# EAGLE design main (EAGLE 9.2.0)
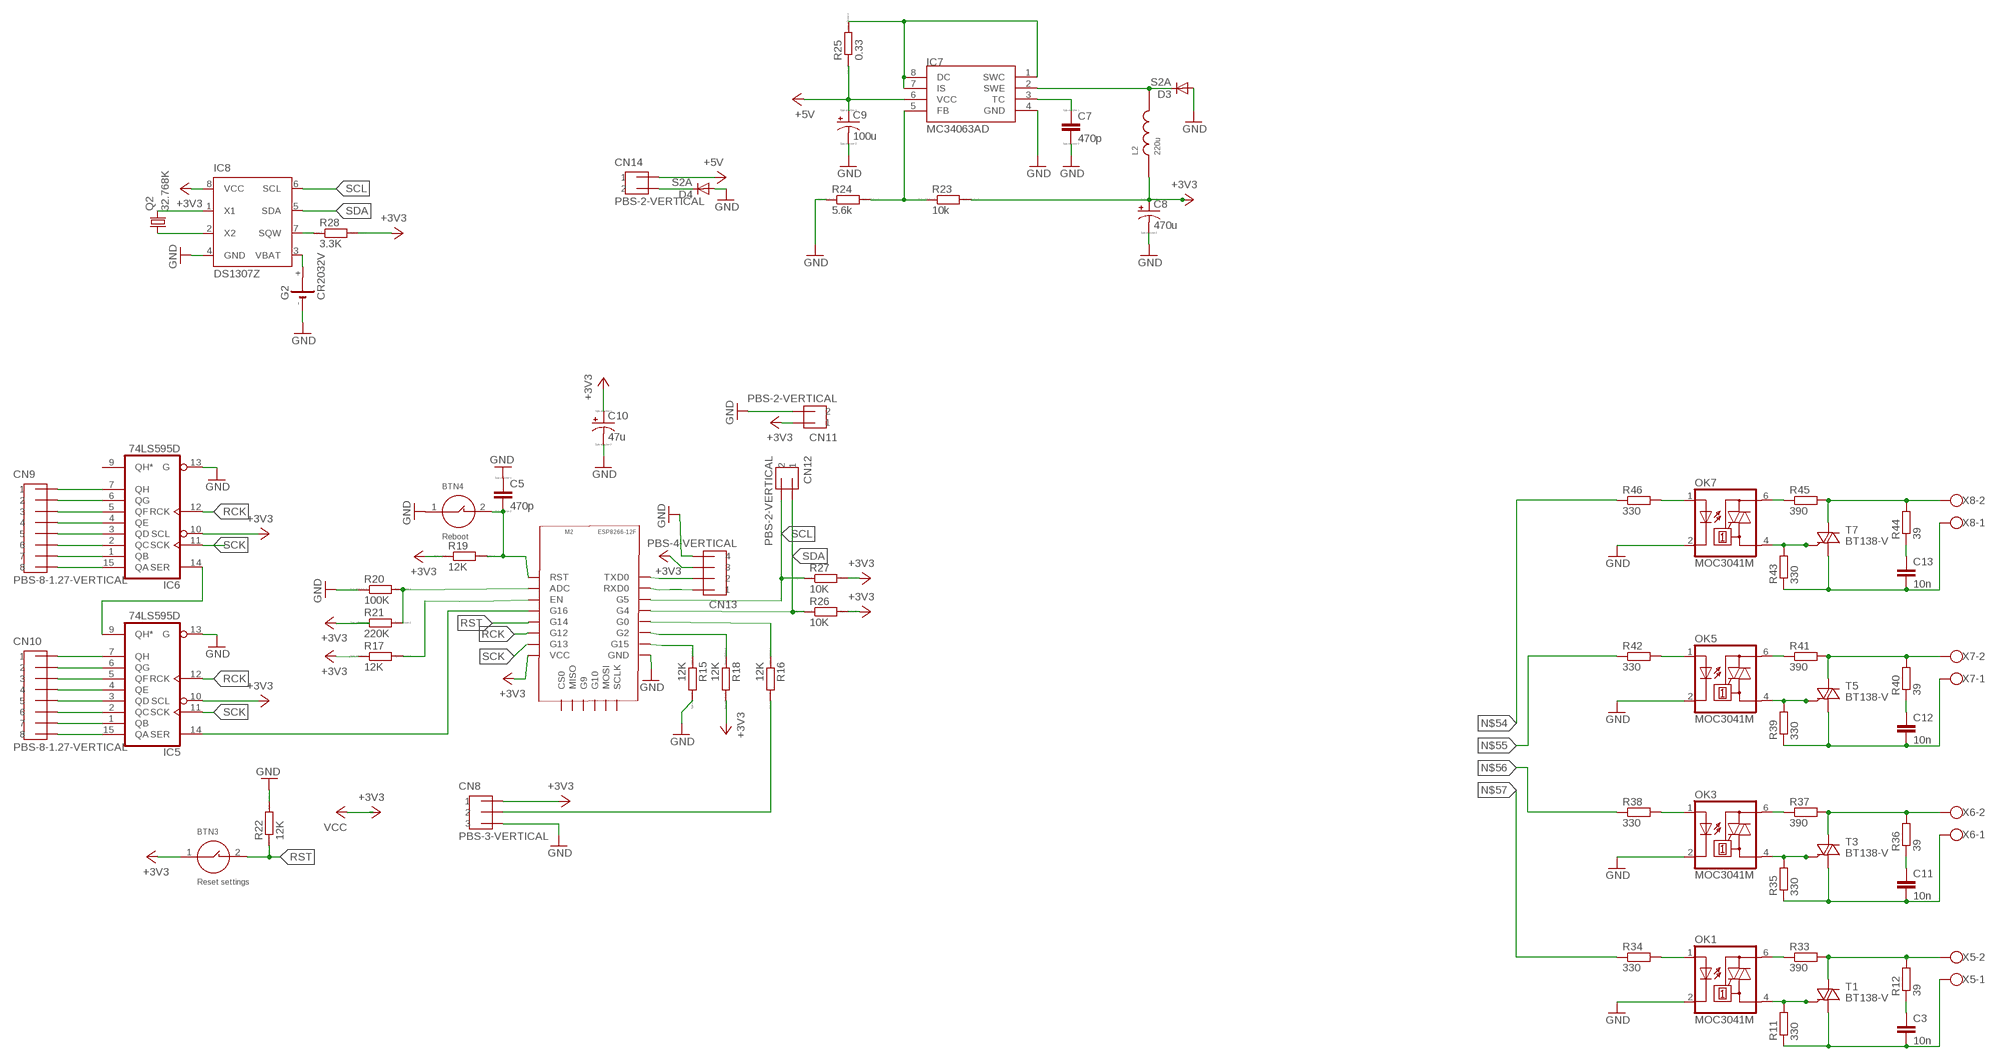
[diagram p0: schematic, sheet 1]

## Parts
BTN3  Reset settings  BTN-6X4-SMD  [BTN-6X4-SMD]
BTN4  Reboot  BTN-6X4-SMD  [BTN-6X4-SMD]
C3  10n  C10/5  [C10B5]
C5  470p  CC0603  [C0603]
C7  470p  CC0603  [C0603]
C8  470u  CPOL-USD/7343-31W  [D/7343-31W]
C9  100u  CPOL-USD/7343-31W  [D/7343-31W]
C10  47u  CPOL-USCT3216  [CT3216]
C11  10n  C10/5  [C10B5]
C12  10n  C10/5  [C10B5]
C13  10n  C10/5  [C10B5]
CN8  PBS-3-VERTICAL  [PBS-3-VERTICAL]
CN9  PBS-8-1.27-VERTICAL  [PBS-8-1.27-VERTICAL]
CN10  PBS-8-1.27-VERTICAL  [PBS-8-1.27-VERTICAL]
CN11  PBS-2-VERTICAL  [PBS-2-VERTICAL]
CN12  PBS-2-VERTICAL  [PBS-2-VERTICAL]
CN13  PBS-4-VERTICAL  [PBS-4-VERTICAL]
CN14  PBS-2-VERTICAL  [PBS-2-VERTICAL]
D3  S2A  [DO214AA]
D4  S2A  [DO214AA]
G2  CR2032V  [CR2032V]
IC5  74LS595D  [SO16]
IC6  74LS595D  [SO16]
IC7  MC34063AD  [SOIC8]
IC8  DS1307Z  [SOIC8]
L2  220u  INDUCTOR-5-10  [INDUCTOR-5-10]
M2  ESP8266-12F  [ESP8266-12F]
OK1  MOC3041M  [DIL06]
OK3  MOC3041M  [DIL06]
OK5  MOC3041M  [DIL06]
OK7  MOC3041M  [DIL06]
Q2  32.768K  CRYSTALTC38H  [TC38H]
R11  330  R-EU_0411/12  [0411/12]
R12  39  R-EU_0411/12  [0411/12]
R15  12K  RR0603  [R0603]
R16  12K  RR0603  [R0603]
R17  12K  RR0603  [R0603]
R18  12K  RR0603  [R0603]
R19  12K  RR0603  [R0603]
R20  100K  RR0603  [R0603]
R21  220K  RR0603  [R0603]
R22  12K  RR0603  [R0603]
R23  10k  RR0603  [R0603]
R24  5.6k  RR0603  [R0603]
R25  0.33  RR0603  [R0603]
R26  10K  RR0603  [R0603]
R27  10K  RR0603  [R0603]
R28  3.3K  RR0603  [R0603]
R33  390  R-EU_0411/12  [0411/12]
R34  330  R-EU_R0603  [R0603]
R35  330  R-EU_0411/12  [0411/12]
R36  39  R-EU_0411/12  [0411/12]
R37  390  R-EU_0411/12  [0411/12]
R38  330  R-EU_R0603  [R0603]
R39  330  R-EU_0411/12  [0411/12]
R40  39  R-EU_0411/12  [0411/12]
R41  390  R-EU_0411/12  [0411/12]
R42  330  R-EU_R0603  [R0603]
R43  330  R-EU_0411/12  [0411/12]
R44  39  R-EU_0411/12  [0411/12]
R45  390  R-EU_0411/12  [0411/12]
R46  330  R-EU_R0603  [R0603]
T1  BT138-V  [TO220BV]
T3  BT138-V  [TO220BV]
T5  BT138-V  [TO220BV]
T7  BT138-V  [TO220BV]
X5  W237-102  [W237-102]
X6  W237-102  [W237-102]
X7  W237-102  [W237-102]
X8  W237-102  [W237-102]

## Nets
+3V3: BTN3.1 C8.+ C10.-(+) CN8.P$1 CN11.P$1 CN13.P$3 IC5.10(SCL) IC6.10(SCL) IC8.8(VCC) L2.P$1 M2.VCC R17.1 R18.2 R19.1 R21.1 R23.2 R26.2 R27.2 R28.2 ; supply symbol labelled VCC
+5V: C9.+ CN14.P$1 IC7.6(VCC) R25.1
GND: BTN4.1 C5.1 C7.2 C8.- C9.- C10.+(-) CN8.P$3 CN11.P$2 CN13.P$4 D3.A D4.A G2.- IC5.13(G) IC6.13(G) IC7.4(GND) IC8.4(GND) M2.GND OK1.2(C) OK3.2(C) OK5.2(C) OK7.2(C) R15.2 R20.1 R22.2 R24.1
N$22: OK1.1(A) R34.2
N$23: OK1.6(A2) R33.1
N$24: OK1.4(A1) R11.2 T1.G
N$32: R12.2 R33.2 T1.T2(A2) X5.2
N$33: C3.2 R11.1 T1.T1(A1) X5.1
N$34: C3.1 R12.1
N$36: OK3.1(A) R38.2
N$37: M2.G15 R15.1
N$38: M2.G2 R18.1
N$39: M2.G0 R16.1
N$40: CN8.P$2 R16.2
N$41: M2.EN R17.2
N$42: CN9.P$1 IC6.7(QH)
N$43: CN9.P$2 IC6.6(QG)
N$44: CN9.P$3 IC6.5(QF)
N$45: CN9.P$4 IC6.4(QE)
N$46: CN9.P$5 IC6.3(QD)
N$47: CN9.P$6 IC6.2(QC)
N$48: CN9.P$7 IC6.1(QB)
N$49: CN9.P$8 IC6.15(QA)
N$50: CN10.P$1 IC5.7(QH)
N$51: CN10.P$2 IC5.6(QG)
N$52: CN10.P$3 IC5.5(QF)
N$53: CN10.P$4 IC5.4(QE)
N$54: CN10.P$5 IC5.3(QD) R46.1
N$55: CN10.P$6 IC5.2(QC) R42.1
N$56: CN10.P$7 IC5.1(QB) R38.1
N$57: CN10.P$8 IC5.15(QA) R34.1
N$58: IC5.14(SER) M2.G16
N$59: IC5.9(QH*) IC6.14(SER)
N$60: BTN4.2 C5.2 M2.RST R19.2
N$61: CN13.P$1 M2.RXD0
N$62: CN13.P$2 M2.TXD0
N$63: M2.ADC R20.2 R21.2
N$64: IC8.7(SQW) R28.1
N$65: IC8.1(X1) Q2.2
N$66: IC8.2(X2) Q2.1
N$67: G2.+ IC8.3(VBAT)
N$68: IC7.5(FB) R23.1 R24.2
N$69: IC7.1(SWC) IC7.7(IS) IC7.8(DC) R25.2
N$70: C7.1 IC7.3(TC)
N$71: D3.C IC7.2(SWE) L2.P$2
N$72: CN14.P$2 D4.C
N$73: OK3.6(A2) R37.1
N$74: OK3.4(A1) R35.2 T3.G
N$75: R36.2 R37.2 T3.T2(A2) X6.2
N$76: C11.2 R35.1 T3.T1(A1) X6.1
N$77: C11.1 R36.1
N$79: OK5.1(A) R42.2
N$80: OK5.6(A2) R41.1
N$81: OK5.4(A1) R39.2 T5.G
N$82: R40.2 R41.2 T5.T2(A2) X7.2
N$83: C12.2 R39.1 T5.T1(A1) X7.1
N$84: C12.1 R40.1
N$86: OK7.1(A) R46.2
N$87: OK7.6(A2) R45.1
N$88: OK7.4(A1) R43.2 T7.G
N$89: R44.2 R45.2 T7.T2(A2) X8.2
N$90: C13.2 R43.1 T7.T1(A1) X8.1
N$91: C13.1 R44.1
RCK: IC5.12(RCK) IC6.12(RCK) M2.G12
RST: BTN3.2 M2.G14 R22.1
SCK: IC5.11(SCK) IC6.11(SCK) M2.G13
SCL: CN12.P$2 IC8.6(SCL) M2.G5 R27.1
SDA: CN12.P$1 IC8.5(SDA) M2.G4 R26.1
Unconnected: G2.+@1(+) IC6.9(QH*) M2.CS0 M2.G9 M2.G10 M2.MISO M2.MOSI M2.SCLK

## Power pins joined to a net without a drawn wire
+3V3: IC5.16(VCC) IC6.16(VCC)
GND: IC5.8(GND) IC6.8(GND)

## Library data of the parts
BTN3 BTN4 = btn1:BTN-6X4-SMD
C3 C11-C13 = capacitor-wima:C: CAPACITOR naming: grid - package width
C5 C7 = eagle-ltspice:C: CAPACITOR, European symbol; SPICEMODEL: NONE; SPICEPREFIX: C
C8-C10 = resistor:CPOL-US: POLARIZED CAPACITOR, American symbol
CN8 = pls:PBS-3-VERTICAL
CN9 CN10 = pls:PBS-8-1.27-VERTICAL
CN11 CN12 CN14 = pls:PBS-2-VERTICAL
CN13 = pls:PBS-4-VERTICAL
D3 D4 = s2x_10:S2*: S2A - S2M General Purpose Rectifiers Source: http://www.fairchildsemi.com/datasheets/S2/S2A.pdf; MF: Fairchild; MPN: S2A; OC_FARNELL: 1467485; OC_NEWARK: 58K2391
G2 = battery:CR2032V: LI BATTERY Varta
IC5 IC6 = 74xx-us:74*595: 8-bit SHIFT REGISTER, output latch
IC7 = mc34063:MC34063
IC8 = ds1307_pcf8583:DS1307: I2C-Bus CLOCK/CALENDAR
L2 = inductor:INDUCTOR-5-10
M2 = ESP8266-12F:ESP8266-12F: ESP8266-12F Author: Konstantin Polyakov Date: March, 2018
OK1 OK3 OK5 OK7 = optocoupler:MOC30*: 6-Pin DIP Zero-Cross Optoisolators Triac Driver Output (250/400 Volt Peak) Source: Data sheet <http://www.fairchildsemi.com/ds/MO/MOC3031M.pdf> The old path of data sheet not more available 2013-05-06.; MF: FAIRCHILD SEMICONDUCTOR; MPN: MOC3041M; OC_FARNELL: 1086677; OC_NEWARK: 78K6090
Q2 = crystal:CRYSTAL: CRYSTAL; OC_FARNELL: unknown; OC_NEWARK: unknown
R11 R12 R33-R46 = resistor:R-EU_: RESISTOR, European symbol
R15-R28 = eagle-ltspice:R: RESISTOR, European symbol; SPICEMODEL: NONE; SPICEPREFIX: R
T1 T3 T5 T7 = triac:BT138: TRIAC Source: http://www.semiconductors.philips.com BT138_SERIES_2.pdf
X5-X8 = con-wago-500:W237-102: WAGO SCREW CLAMP; MPN: 237-102; OC_FARNELL: unknown; OC_NEWARK: 70K9898

## Board
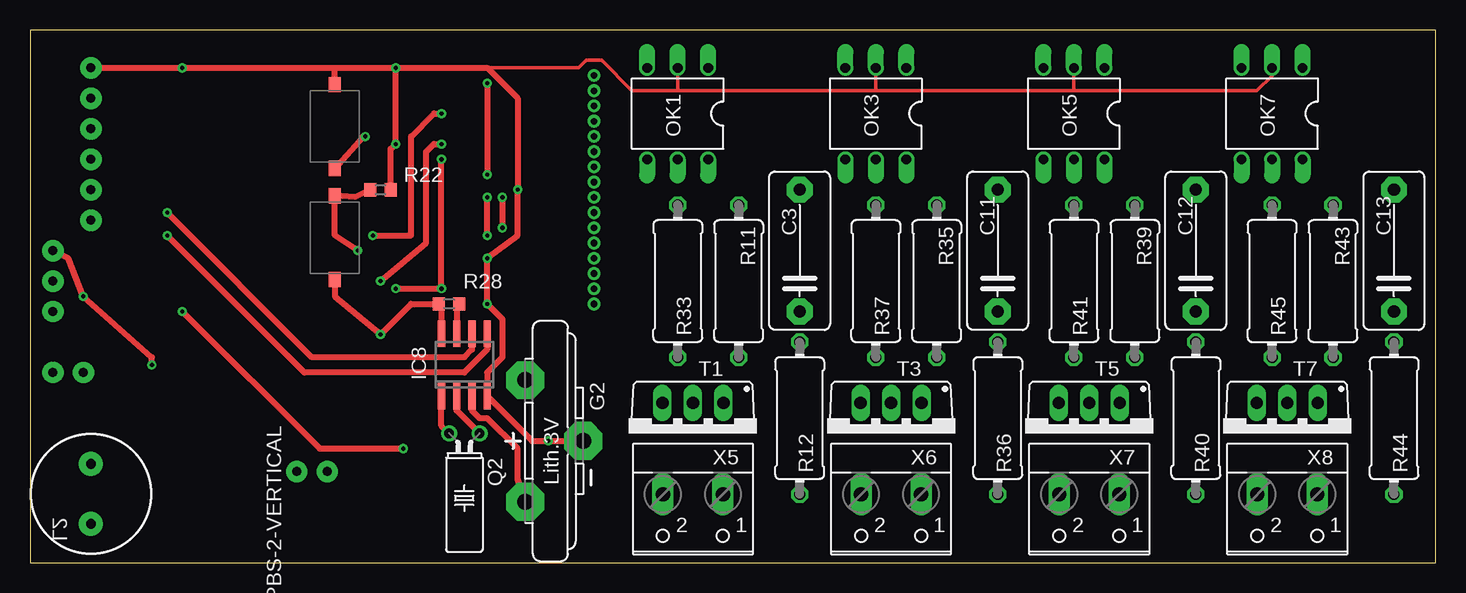
[diagram p1: board, top side]
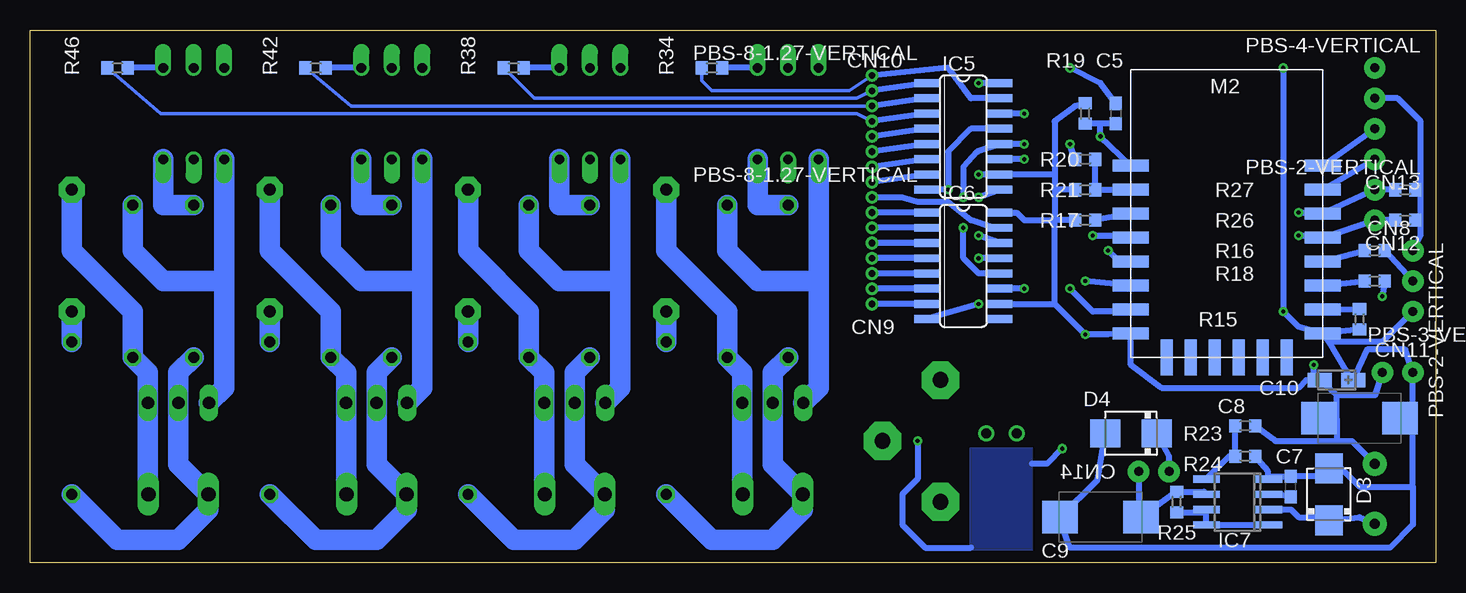
[diagram p2: board, bottom side, seen from below]

Size 117.14 x 44.44 mm. Coordinates in mm from the lower left corner, seen from the top.
Outline: 0,0 117.14,0 117.14,44.44 0,44.44 0,0
Copper layers (1*16): Top 0.035mm / dielectric 1.5mm / Bottom 0.035mm
Design rules "default": minimum track width 6mil, minimum drill 0.35mm, track to track 6mil, track to pad 6mil, pad to pad 6mil, via to via 6mil, smd to smd 6mil, copper to edge 40mil, drill to drill 6mil, minimum pad ring 10mil, minimum via ring 8mil, stop-mask expansion 4mil, vias tented up to drill 0mil, thermal gap 10mil

### Footprints (pad centres in the part's own frame; a part is rotated, then mirrored left to right if it is on the bottom)
BTN-6X4-SMD = smd 1.25 x 1: 1 -0.508,0 | smd 1.27 x 1: 2 6.477,0
C10B5 = drill 1.016 pad 2.159 octagon: 1 -5.08,0; 2 5.08,0
C0603 = smd 1.1 x 1: 1 -0.85,0; 2 0.85,0
D/7343-31W = smd 2.95 x 2.7: + 3.375,0; - -3.375,0
CT3216 = smd 2 x 1.2: + -1.4,0; - 1.4,0
PBS-3-VERTICAL = drill 0.75 pad 1.778: P$1 0,0; P$2 0,-2.54; P$3 0,-5.08
PBS-8-1.27-VERTICAL = drill 0.55 pad 1: P$1 0,0; P$2 0,-1.27; P$3 0,-2.54; P$4 0,-3.81; P$5 0,-5.08; P$6 0,-6.35; P$7 0,-7.62; P$8 0,-8.89
PBS-2-VERTICAL = drill 0.75 pad 1.778: P$1 0,0; P$2 0,-2.54
PBS-4-VERTICAL = drill 0.75 pad 1.778: P$1 0,0; P$2 0,-2.54; P$3 0,-5.08; P$4 0,-7.62
DO214AA = smd 2.5 x 2.3: A 2.15,0; C -2.15,0
CR2032V = drill 1.321 pad 3.15 octagon: + -2.54,-5.08; +@1 -2.54,5.08; - 2.286,0
SO16 = smd 0.66 x 2.032: 1 -4.445,-3.073; 2 -3.175,-3.073; 3 -1.905,-3.073; 4 -0.635,-3.073; 5 0.635,-3.073; 6 1.905,-3.073; 7 3.175,-3.073; 8 4.445,-3.073; 9 4.445,3.073; 10 3.175,3.073; 11 1.905,3.073; 12 0.635,3.073; 13 -0.635,3.073; 14 -1.905,3.073; 15 -3.175,3.073; 16 -4.445,3.073
SOIC8 = smd 0.6 x 2.2: 1 -1.905,-2.6; 2 -0.635,-2.6; 3 0.635,-2.6; 4 1.905,-2.6; 5 1.905,2.6; 6 0.635,2.6; 7 -0.635,2.6; 8 -1.905,2.6
INDUCTOR-5-10 = drill 0.8 pad 2: P$1 0,0; P$2 5,0
ESP8266-12F = smd 3 x 1: ADC 0,14; EN 0,12; G0 16,8; G2 16,6; G4 16,10; G5 16,12; G12 0,6; G13 0,4; G14 0,8; G15 16,4; G16 0,10; GND 16,2; RST 0,16; RXD0 16,14; TXD0 16,16; VCC 0,2 | smd 1 x 3: CS0 3,0; G9 7,0; G10 9,0; MISO 5,0; MOSI 11,0; SCLK 13,0
DIL06 = drill 0.813 offset: 1 -2.54,-3.81; 2 0,-3.81; 3 2.54,-3.81; 4 2.54,3.81; 5 0,3.81; 6 -2.54,3.81
TC38H = drill 0.813: 1 -1.27,0; 2 1.27,0
0411/12 = drill 0.914 octagon: 1 -6.35,0; 2 6.35,0
R0603 = smd 1 x 1.1: 1 -0.85,0; 2 0.85,0
TO220BV = drill 1.016 long: G 2.54,-2.54; T1 -2.54,-2.54; T2 0,-2.54
W237-102 = drill 1.194 long: 1 -2.5,-1.27; 2 2.5,-1.27

### Placement (x,y rotation side)
BTN3  25.4,24.13 90 top
BTN4  25.4,39.37 270 top
C3  64.14,26.04 90 top
C5  26.67,37.47 270 bottom
C7  12.06,6.35 90 bottom
C8  6.35,12.06 180 bottom
C9  27.94,3.81 0 bottom
C10  8.26,15.24 180 bottom
C11  80.64,26.04 90 top
C12  97.16,26.04 90 top
C13  113.67,26.04 90 top
CN8  1.91,26.04 0 bottom
CN9  46.99,21.59 180 bottom
CN10  46.99,31.75 180 bottom
CN11  4.45,15.88 90 bottom
CN12  5.08,28.57 180 bottom
CN13  5.08,33.66 180 bottom
CN14  24.77,7.62 270 top
D3  8.89,5.71 90 bottom
D4  25.4,10.79 180 bottom
G2  43.81,10.16 0 top
IC5  39.37,35.56 270 bottom
IC6  39.37,24.77 270 bottom
IC7  16.51,5.08 90 bottom
IC8  36.2,16.51 0 top
L2  5.08,8.26 270 top
M2  25.4,17.14 0 bottom
OK1  53.98,37.47 180 top
OK3  70.48,37.47 180 top
OK5  87,37.47 180 top
OK7  103.5,37.47 180 top
Q2  36.2,10.79 180 top
R11  59.05,23.5 90 top
R12  64.14,12.06 270 top
R15  6.35,20.32 270 bottom
R16  5.08,26.04 0 bottom
R17  29.21,28.57 0 bottom
R18  5.08,23.5 0 bottom
R19  29.21,37.47 270 bottom
R20  29.21,33.66 0 bottom
R21  29.21,31.11 0 bottom
R22  29.21,31.11 0 top
R23  15.88,11.43 0 bottom
R24  15.88,8.89 180 bottom
R25  21.59,5.08 270 bottom
R26  2.54,28.57 0 bottom
R27  2.54,31.11 0 bottom
R28  34.92,21.59 180 top
R33  53.98,23.5 270 top
R34  60.33,41.27 0 bottom
R35  75.56,23.5 90 top
R36  80.64,12.06 270 top
R37  70.48,23.5 270 top
R38  76.83,41.27 0 bottom
R39  92.08,23.5 90 top
R40  97.16,12.06 270 top
R41  87,23.5 270 top
R42  93.34,41.27 0 bottom
R43  108.58,23.5 90 top
R44  113.67,12.06 270 top
R45  103.5,23.5 270 top
R46  109.86,41.27 0 bottom
T1  55.24,10.79 180 top
T3  71.75,10.79 180 top
T5  88.27,10.79 180 top
T7  104.78,10.79 180 top
X5  55.24,4.45 180 top
X6  71.75,4.45 180 top
X7  88.27,4.45 180 top
X8  104.78,4.45 180 top

### Tracks (layer width: path | path; a pad name or v marks a point on that pad's centre or on a via)
+3V3  (via drill 0.35)
  Top 0.5: v38.1,40.01 v38.1,32.38 | BTN3.1 25.4,22.23 v29.21,19.05 31.75,21.59 R28.2 34.29,21.38 IC8.8 | CN8.P$1 3.17,25.4 v4.45,22.23 10.16,17.14 v10.16,16.51
  Bottom 0.5: R17.1 31.75,28.57 | R19.1 30.06,38.1 31.75,36.83 31.75,32.38 | IC6.16 34.92,29.21 34.29,28.57 31.75,28.57 | 36.83,40.01 IC5.16 v38.1,40.01 | R18.2 v4.45,22.23 | 31.75,21.59 31.75,28.57 | 31.75,31.11 31.75,28.57 | 31.75,32.38 31.75,31.11 | R23.2 13.34,10.16 8.26,10.16 | 8.26,10.16 6.99,10.16 L2.P$1 | CN11.P$1 5.08,13.97 8.26,13.97 | C10.- 8.26,13.97 | 8.26,10.16 8.26,12.05 C8.+ 8.26,12.08 8.26,13.97 | R21.1 31.75,31.11 | 31.75,32.38 IC5.10 v38.1,32.38 | 31.75,21.59 v29.21,19.05 27.3,19.05 M2.VCC 25.4,16.51 22.86,14.61 11.43,14.61 10.79,15.24 C10.- | IC6.10 31.75,21.59 | CN8.P$1 1.27,27.3 1.27,28.57 | 1.27,28.57 1.27,31.11 | 1.27,31.11 1.27,36.83 3.17,38.73 CN13.P$3 | R27.2 1.27,31.11 | R26.2 1.27,28.57 | C10.- 10.16,15.74 v10.16,16.51
+5V
  Bottom 0.5: IC7.6 19.32,5.93 R25.1 21.48,6.04 C9.+ 24.77,5.08 CN14.P$1
GND  (via drill 0.35)
  Top 0.3: 38.1,41.27 45.72,41.27 46.35,41.91 47.62,41.91 50.16,39.37 53.98,39.37 | 53.98,39.37 70.48,39.37 | 70.48,39.37 87,39.37 | 87,39.37 102.23,39.37 103.5,40.64 OK7.2 | OK5.2 87,39.37 | OK3.2 70.48,39.37 | OK1.2 53.98,39.37
  Top 0.5: v30.48,41.27 v30.48,34.92 30.06,34.51 R22.2 | 25.4,41.27 v12.7,41.27 CN13.P$4 | 25.4,41.27 v30.48,41.27 | v30.48,41.27 38.1,41.27 40.64,38.73 v40.64,31.11 40.64,27.3 v38.1,25.4 v38.1,21.59 39.37,20.32 39.37,17.14 38.1,15.88 IC8.4 41.85,10.16 v43.18,10.16 G2.- | BTN4.1 25.4,41.27 | v12.7,20.95 24.13,9.53 v31.11,9.53
  Bottom 0.5: R15.2 M2.GND | R20.1 v30.48,34.92 | C5.1 27.94,40.01 v30.48,41.27 | v38.1,21.59 IC6.8 | IC5.13 38.73,36.2 40.64,34.29 v40.64,31.11 IC5.8 | M2.GND 11.43,19.68 v12.7,20.95 v12.7,41.27 | 8.89,18.41 M2.GND | CN8.P$3 4.45,18.41 8.89,18.41 | IC6.13 v38.1,25.4 | R24.1 13.97,7.62 13.97,7.04 IC7.4 13.7,7.2 C7.2 9.49,7.23 D3.A 8.5,8.5 6.35,6.35 1.91,6.35 | 1.91,6.35 1.91,3.17 3.81,1.27 30.48,1.27 C9.- | 1.91,6.35 1.91,11.43 | 1.91,11.43 CN11.P$2 2.54,17.78 5.71,17.78 C10.+ 6.99,15.24 8.89,18.41 | 1.91,11.43 C8.- | D4.A 28.18,6.94 C9.- | C9.- 31.95,4.45 | v31.11,9.53 32.38,8.26 33.66,8.26 | 38.73,1.27 42.55,1.27 44.45,3.17 44.45,5.71 43.18,6.99 v43.18,10.16
  pour Bottom: 33.66,9.53 38.73,9.53 38.73,0.64 33.66,0.64
N$22
  Bottom 0.5: OK1.1 R34.2
N$23
  Bottom 1.7: OK1.6 56.52,29.84 R33.1
N$24
  Bottom 1.7: OK1.4 51.44,23.5 | 51.44,23.5 51.44,14.61 T1.G | R11.2 59.05,26.04 56.52,23.5 51.44,23.5
N$32
  Bottom 1.7: R33.2 55.24,15.88 T1.T2 | T1.T2 55.24,12.06 | R12.2 60.33,1.91 55.24,1.91 52.74,4.41 X5.2 55.24,8.21 T1.T2
N$33
  Bottom 1.7: C3.2 64.14,26.04 59.05,20.95 R11.1 57.78,15.88 T1.T1 57.78,5.75 X5.1
N$34
  Bottom 1.7: R12.1 C3.1
N$36
  Bottom 0.5: OK3.1 R38.2
N$37
  Bottom 0.5: M2.G15 R15.1
N$38
  Bottom 0.5: M2.G2 R18.1
N$39
  Bottom 0.5: M2.G0 R16.1
N$40
  Bottom 0.5: CN8.P$2 R16.2
N$41
  Bottom 0.5: M2.EN R17.2
N$42
  Bottom 0.5: IC6.7 CN9.P$1
N$43
  Bottom 0.5: IC6.6 CN9.P$2
N$44
  Bottom 0.5: IC6.5 CN9.P$3
N$45
  Bottom 0.5: IC6.4 CN9.P$4
N$46
  Bottom 0.5: IC6.3 CN9.P$5
N$47
  Bottom 0.5: IC6.2 CN9.P$6
N$48
  Bottom 0.5: IC6.1 CN9.P$7
N$49
  Bottom 0.5: IC6.15 36.93,27.94 38.73,28.57 40.64,30.1 43.18,30.1 44.45,30.48 CN9.P$8
N$50
  Bottom 0.5: IC5.7 CN10.P$1
N$51
  Bottom 0.5: IC5.6 CN10.P$2
N$52
  Bottom 0.5: IC5.5 CN10.P$3
N$53
  Bottom 0.5: IC5.4 CN10.P$4
N$54
  Bottom 0.3: R46.1 106.26,37.47 48.26,37.47 CN10.P$5
  Bottom 0.5: IC5.3 CN10.P$5
N$55
  Bottom 0.3: R42.1 90.39,38.1 CN10.P$6
  Bottom 0.5: IC5.2 CN10.P$6
N$56
  Bottom 0.3: R38.1 75.14,38.73 48.26,38.73 CN10.P$7
  Bottom 0.5: IC5.1 CN10.P$7
N$57
  Bottom 0.3: R34.1 61.17,40.22 60.33,39.37 48.9,39.37 CN10.P$8
  Bottom 0.5: IC5.15 38.73,38.73 40.64,41.27 CN10.P$8
N$58  (via drill 0.35)
  Top 0.5: v28.57,27.3 31.75,27.3 31.75,35.56 33.66,37.47 v34.29,37.47
  Bottom 0.5: v34.29,37.47 IC5.14 | v28.57,27.3 25.56,27.3 M2.G16
N$59  (via drill 0.35)
  Top 0.5: v38.1,27.3 v38.1,30.48
  Bottom 0.5: IC6.14 v38.1,27.3 | IC5.9 v38.1,30.48
N$60  (via drill 0.35)
  Top 0.5: BTN4.2 27.77,35.56 v27.94,35.56
  Bottom 0.5: C5.2 27.94,36.62 | 27.94,36.62 R19.2 | M2.RST v27.94,35.56 27.94,36.62
N$61
  Bottom 0.5: M2.RXD0 CN13.P$1
N$62
  Bottom 0.5: M2.TXD0 CN13.P$2
N$63
  Bottom 0.5: R20.2 R21.2 26.67,31.11 26.64,31.14 M2.ADC
N$64
  Top 0.5: R28.1 35.56,21.38 IC8.7
N$65
  Top 0.5: Q2.2 34.29,11.43 IC8.1
N$66
  Top 0.5: Q2.1 35.56,12.7 IC8.2
N$67
  Top 0.5: G2.+ 40.64,6.99 40.64,9.53 38.1,12.06 37.47,12.06 36.83,12.7 IC8.3
N$68
  Bottom 0.5: 19.27,6.99 IC7.5 | 19.05,6.99 IC7.5 | IC7.5 17.2,8.89 R24.2 R23.1
N$69
  Bottom 0.5: IC7.1 IC7.8 IC7.7 19.32,4.23 R25.2
N$70
  Bottom 0.5: IC7.3 12.91,5.71 C7.1
N$71
  Bottom 0.5: IC7.2 12.06,4.45 11.43,3.81 10.16,3.81 D3.C 6.35,3.81 L2.P$2
N$72
  Bottom 0.5: CN14.P$2 22.23,8.89 D4.C
N$73
  Bottom 1.7: OK3.6 73.03,29.84 R37.1
N$74
  Bottom 1.7: OK3.4 67.94,23.5 | 67.94,23.5 67.94,14.61 T3.G | R35.2 75.56,26.04 73.03,23.5 67.94,23.5
N$75
  Bottom 1.7: R37.2 71.75,15.88 T3.T2 | T3.T2 71.75,12.06 | R36.2 76.83,1.91 71.75,1.91 69.25,4.41 X6.2 71.75,8.21 T3.T2
N$76
  Bottom 1.7: C11.2 80.64,26.04 75.56,20.95 R35.1 74.3,15.88 T3.T1 74.3,5.75 X6.1
N$77
  Bottom 1.7: R36.1 C11.1
N$79
  Bottom 0.5: OK5.1 R42.2
N$80
  Bottom 1.7: OK5.6 89.53,29.84 R41.1
N$81
  Bottom 1.7: OK5.4 84.45,23.5 | 84.45,23.5 84.45,14.61 T5.G | R39.2 92.08,26.04 89.53,23.5 84.45,23.5
N$82
  Bottom 1.7: R41.2 88.27,15.88 T5.T2 | T5.T2 88.27,12.06 | R40.2 93.34,1.91 88.27,1.91 85.77,4.41 X7.2 88.27,8.21 T5.T2
N$83
  Bottom 1.7: C12.2 97.16,26.04 92.08,20.95 R39.1 90.81,15.88 T5.T1 90.81,5.75 X7.1
N$84
  Bottom 1.7: R40.1 C12.1
N$86
  Bottom 0.5: OK7.1 R46.2
N$87
  Bottom 1.7: OK7.6 106.05,29.84 R45.1
N$88
  Bottom 1.7: OK7.4 100.97,23.5 | 100.97,23.5 100.97,14.61 T7.G | R43.2 108.58,26.04 106.05,23.5 100.97,23.5
N$89
  Bottom 1.7: R45.2 104.78,15.88 T7.T2 | T7.T2 104.78,12.06 | R44.2 109.86,1.91 104.78,1.91 102.28,4.41 X8.2 104.78,8.21 T7.T2
N$90
  Bottom 1.7: C13.2 113.67,26.04 108.58,20.95 R43.1 107.31,15.88 T7.T1 107.31,5.75 X8.1
N$91
  Bottom 1.7: R44.1 C13.1
RCK  (via drill 0.35)
  Top 0.5: v29.21,23.5 33.02,26.67 33.02,34.29 33.66,34.92 v34.29,34.92 | v39.37,30.48 v39.37,27.94
  Bottom 0.5: M2.G12 v29.21,23.5 | v34.29,34.92 IC5.12 38.2,34.29 39.37,33.02 v39.37,30.48 | IC6.12 38.1,24.13 39.37,25.4 v39.37,27.94
RST  (via drill 0.35)
  Top 0.5: v27.3,26.04 25.4,27.3 BTN3.2 27.09,30.52 R22.1
  Bottom 0.5: v27.3,26.04 26.67,25.4 25.66,25.4 M2.G14
SCK  (via drill 0.35)
  Top 0.5: v30.48,22.86 v34.29,22.86 v34.29,33.66
  Bottom 0.5: M2.G13 25.84,20.95 28.57,20.95 v30.48,22.86 | v34.29,33.66 IC5.11 | v34.29,22.86 IC6.11
SCL  (via drill 0.35)
  Top 0.5: IC8.6 36.83,17.78 36.2,17.14 23.5,17.14 v11.43,29.21
  Bottom 0.5: R27.1 CN12.P$2 M2.G5 9.46,29.21 v11.43,29.21
SDA  (via drill 0.35)
  Top 0.5: IC8.5 38.1,17.78 36.2,15.88 22.86,15.88 v11.43,27.3
  Bottom 0.5: R26.1 CN12.P$1 M2.G4 9.56,27.3 v11.43,27.3

### Text on the board
tValues: - | Polyakov Konstantin / Russia, Yeysk, 2018-05-16, WFPS-0-1-1 / Based on WFR-0-3-1 | + | TX | Reboot | RX | SCL | SDA | | Boot | RST sets | | UART | 16 Channels 1 | 3.3V | - | + | - | + | Power 12V